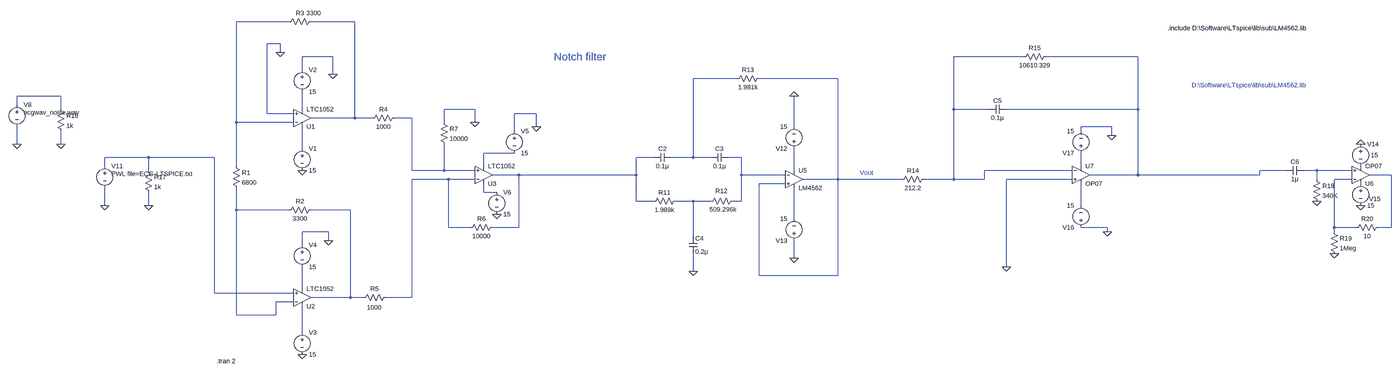
[diagram p0: schematic full_heart_final_final - Copy.asc, whole sheet]
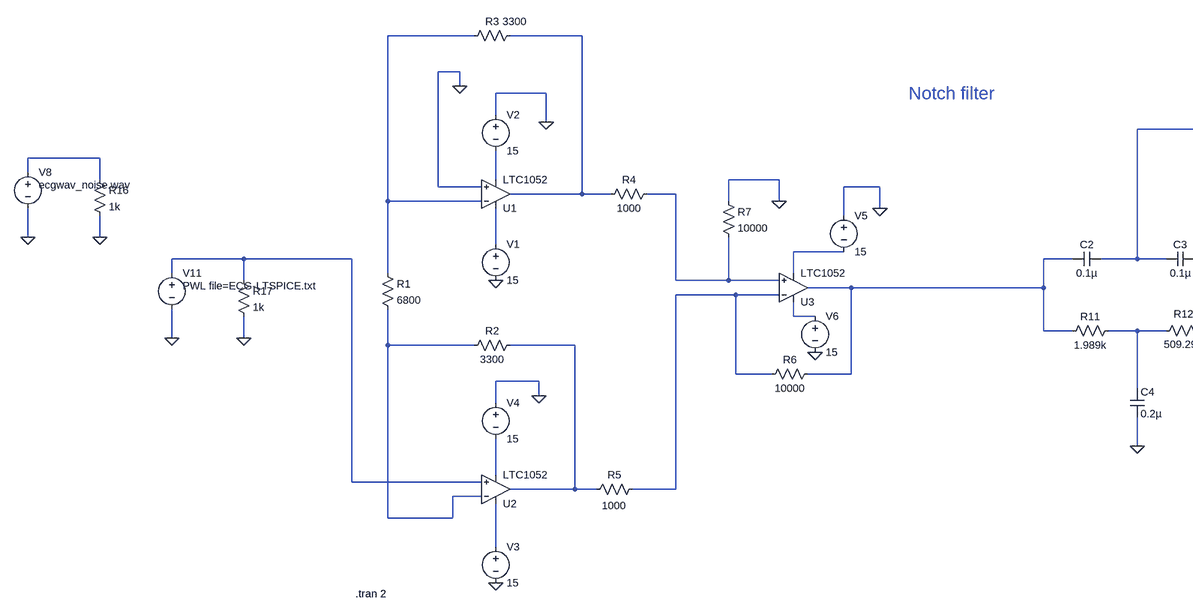
[diagram p1: schematic full_heart_final_final - Copy.asc, part, row 1 of 1, column 1 of 2]
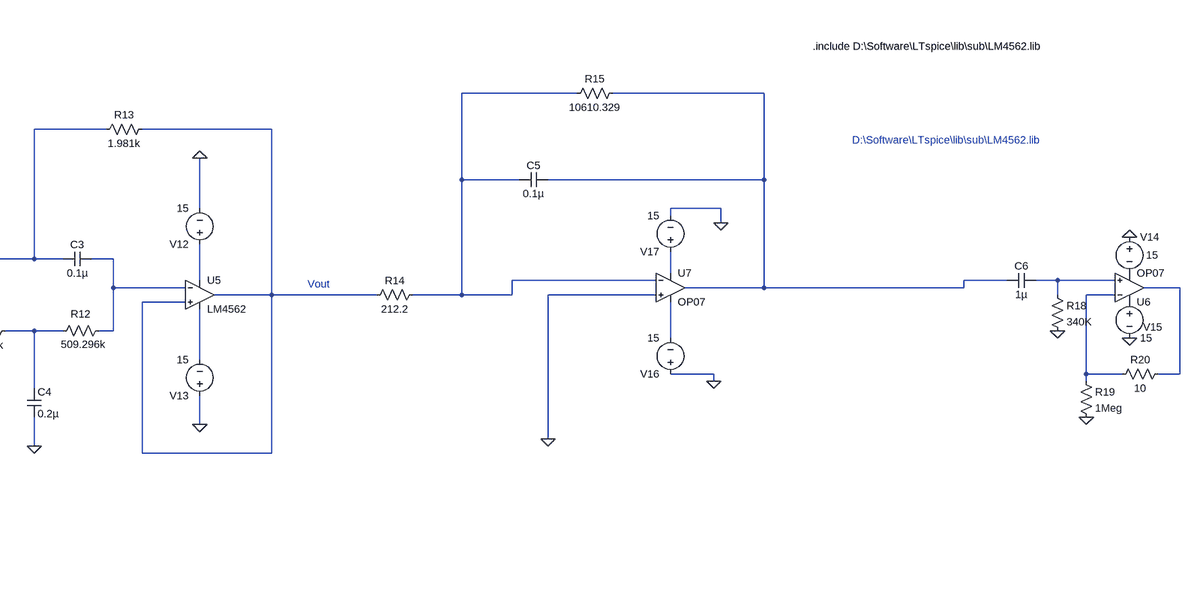
[diagram p2: schematic full_heart_final_final - Copy.asc, part, row 1 of 1, column 2 of 2]
full_heart_final_final - Copy.asc, the LTspice schematic file:
Version 4
SHEET 1 6052 1816
WIRE -992 -208 -1184 -208
WIRE -752 -208 -912 -208
WIRE -1024 -128 -1072 -128
WIRE -1024 -96 -1024 -128
WIRE -832 -80 -944 -80
WIRE 1856 -80 1600 -80
WIRE 2272 -80 1936 -80
WIRE -944 -32 -944 -80
WIRE -832 -16 -832 -80
WIRE 800 0 640 0
WIRE 1168 0 880 0
WIRE -1824 64 -1984 64
WIRE -1984 96 -1984 64
WIRE -1824 112 -1824 64
WIRE -944 112 -944 48
WIRE -256 112 -368 112
WIRE 1600 112 1600 -80
WIRE 1728 112 1600 112
WIRE 2272 112 2272 -80
WIRE 2272 112 1792 112
WIRE -1072 128 -1072 -128
WIRE -976 128 -1072 128
WIRE -32 128 -112 128
WIRE -752 144 -752 -208
WIRE -752 144 -912 144
WIRE -688 144 -752 144
WIRE -544 144 -608 144
WIRE -1184 160 -1184 -208
WIRE -976 160 -1184 160
WIRE -368 160 -368 112
WIRE -256 160 -256 112
WIRE -32 176 -32 128
WIRE 1008 176 1008 64
WIRE 2176 176 2064 176
WIRE -112 192 -112 128
WIRE 2064 192 2064 176
WIRE 2176 208 2176 176
WIRE -1984 240 -1984 176
WIRE -1824 240 -1824 192
WIRE -944 256 -944 176
WIRE -112 272 -224 272
WIRE -1504 288 -1664 288
WIRE -1264 288 -1504 288
WIRE 496 288 432 288
WIRE 640 288 640 0
WIRE 640 288 560 288
WIRE 704 288 640 288
WIRE 816 288 768 288
WIRE -1664 320 -1664 288
WIRE -1184 320 -1184 160
WIRE -224 320 -224 272
WIRE 2064 320 2064 272
WIRE -1504 336 -1504 288
WIRE -544 336 -544 144
WIRE -368 336 -368 240
WIRE -368 336 -544 336
WIRE -256 336 -368 336
WIRE 1008 336 1008 256
WIRE 2032 336 1712 336
WIRE 2832 336 2736 336
WIRE 2944 336 2896 336
WIRE 3072 336 2944 336
WIRE -96 352 -192 352
WIRE 432 352 432 288
WIRE 432 352 -96 352
WIRE 816 352 816 288
WIRE 976 352 816 352
WIRE 2272 352 2272 112
WIRE 2272 352 2096 352
WIRE 2736 352 2736 336
WIRE 2736 352 2272 352
WIRE 3216 352 3136 352
WIRE -352 368 -544 368
WIRE -256 368 -352 368
WIRE 1168 368 1168 0
WIRE 1168 368 1040 368
WIRE 1408 368 1168 368
WIRE 1600 368 1600 112
WIRE 1600 368 1488 368
WIRE 1712 368 1712 336
WIRE 1712 368 1600 368
WIRE 2032 368 1792 368
WIRE 2944 368 2944 336
WIRE 3072 368 3008 368
WIRE 976 384 880 384
WIRE -224 416 -224 384
WIRE -176 416 -224 416
WIRE 432 448 432 352
WIRE 496 448 432 448
WIRE 640 448 576 448
WIRE 704 448 640 448
WIRE 816 448 816 352
WIRE 816 448 784 448
WIRE -1664 464 -1664 400
WIRE -1504 464 -1504 416
WIRE 2064 464 2064 384
WIRE -1184 480 -1184 400
WIRE -992 480 -1184 480
WIRE -768 480 -912 480
WIRE 1008 512 1008 400
WIRE -352 544 -352 368
WIRE -272 544 -352 544
WIRE -96 544 -96 352
WIRE -96 544 -192 544
WIRE 2160 544 2064 544
WIRE 3008 544 3008 368
WIRE 3088 544 3008 544
WIRE 3216 544 3216 352
WIRE 3216 544 3168 544
WIRE -848 560 -944 560
WIRE 2160 560 2160 544
WIRE 3008 560 3008 544
WIRE 640 576 640 448
WIRE -848 592 -848 560
WIRE -944 608 -944 560
WIRE 1008 656 1008 592
WIRE 1792 688 1792 368
WIRE 640 704 640 640
WIRE 880 720 880 384
WIRE 1168 720 1168 368
WIRE 1168 720 880 720
WIRE -944 768 -944 688
WIRE -1264 784 -1264 288
WIRE -976 784 -1264 784
WIRE -768 800 -768 480
WIRE -768 800 -912 800
WIRE -720 800 -768 800
WIRE -544 800 -544 368
WIRE -544 800 -640 800
WIRE -976 816 -1040 816
WIRE -1184 864 -1184 480
WIRE -1040 864 -1040 816
WIRE -1040 864 -1184 864
WIRE -944 928 -944 832
FLAG -256 160 0
FLAG -944 336 0
FLAG -944 1008 0
FLAG -848 592 0
FLAG -832 -16 0
FLAG -176 496 0
FLAG -32 176 0
FLAG -1024 -96 0
FLAG 1008 64 0
FLAG 1008 656 0
FLAG 640 704 0
FLAG 1792 688 0
FLAG 2176 208 0
FLAG 2160 560 0
FLAG -1984 240 0
FLAG -1824 240 0
FLAG -1664 464 0
FLAG -1504 464 0
FLAG 3008 640 0
FLAG 3104 464 0
FLAG 3104 240 0
FLAG 2944 448 0
SYMBOL OpAmps\\LTC1052 -944 208 M180
SYMATTR InstName U1
SYMBOL OpAmps\\LTC1052 -944 864 M180
SYMATTR InstName U2
SYMBOL res -1200 304 R0
SYMATTR InstName R1
SYMATTR Value 6800
SYMBOL res -896 464 R90
WINDOW 0 0 56 VBottom 2
WINDOW 3 32 56 VTop 2
SYMATTR InstName R2
SYMATTR Value 3300
SYMBOL res -896 -224 R90
WINDOW 0 0 56 VBottom 2
WINDOW 3 -31 6 VTop 2
SYMATTR InstName R3
SYMATTR Value 3300
SYMBOL res -592 128 R90
WINDOW 0 0 56 VBottom 2
WINDOW 3 32 56 VTop 2
SYMATTR InstName R4
SYMATTR Value 1000
SYMBOL res -624 784 R90
WINDOW 0 0 56 VBottom 2
WINDOW 3 37 57 VTop 2
SYMATTR InstName R5
SYMATTR Value 1000
SYMBOL OpAmps\\LTC1052 -224 416 M180
SYMATTR InstName U3
SYMBOL res -176 528 R90
WINDOW 0 0 56 VBottom 2
WINDOW 3 32 56 VTop 2
SYMATTR InstName R6
SYMATTR Value 10000
SYMBOL res -384 144 R0
SYMATTR InstName R7
SYMATTR Value 10000
SYMBOL voltage -944 240 R0
WINDOW 123 0 0 Left 0
WINDOW 39 0 0 Left 0
SYMATTR InstName V1
SYMATTR Value 15
SYMBOL voltage -944 -48 R0
WINDOW 123 0 0 Left 0
WINDOW 39 0 0 Left 0
SYMATTR InstName V2
SYMATTR Value 15
SYMBOL voltage -944 912 R0
WINDOW 123 0 0 Left 0
WINDOW 39 0 0 Left 0
SYMATTR InstName V3
SYMATTR Value 15
SYMBOL voltage -944 592 R0
WINDOW 123 0 0 Left 0
WINDOW 39 0 0 Left 0
SYMATTR InstName V4
SYMATTR Value 15
SYMBOL voltage -112 176 R0
WINDOW 123 0 0 Left 0
WINDOW 39 0 0 Left 0
SYMATTR InstName V5
SYMATTR Value 15
SYMBOL voltage -176 400 R0
WINDOW 123 0 0 Left 0
WINDOW 39 0 0 Left 0
SYMATTR InstName V6
SYMATTR Value 15
SYMBOL voltage 1008 272 R180
WINDOW 123 0 0 Left 0
WINDOW 39 0 0 Left 0
SYMATTR InstName V12
SYMATTR Value 15
SYMBOL res 592 432 R90
WINDOW 0 0 56 VBottom 2
WINDOW 3 32 56 VTop 2
SYMATTR InstName R11
SYMATTR Value 1.989k
SYMBOL res 800 432 R90
WINDOW 0 -6 57 VBottom 2
WINDOW 3 31 51 VTop 2
SYMATTR InstName R12
SYMATTR Value 509.296k
SYMBOL cap 560 272 R90
WINDOW 0 0 32 VBottom 2
WINDOW 3 32 32 VTop 2
SYMATTR InstName C2
SYMATTR Value 0.1µ
SYMBOL cap 768 272 R90
WINDOW 0 0 32 VBottom 2
WINDOW 3 32 32 VTop 2
SYMATTR InstName C3
SYMATTR Value 0.1µ
SYMBOL cap 624 576 R0
SYMATTR InstName C4
SYMATTR Value 0.2µ
SYMBOL voltage 1008 608 R180
WINDOW 123 0 0 Left 0
WINDOW 39 0 0 Left 0
SYMATTR InstName V13
SYMATTR Value 15
SYMBOL res 896 -16 R90
WINDOW 0 0 56 VBottom 2
WINDOW 3 32 56 VTop 2
SYMATTR InstName R13
SYMATTR Value 1.981k
SYMBOL OpAmps\\opamp2 1008 304 R0
SYMATTR InstName U5
SYMATTR Value LM4562
SYMBOL res 1504 352 R90
WINDOW 0 0 56 VBottom 2
WINDOW 3 32 56 VTop 2
SYMATTR InstName R14
SYMATTR Value 212.2
SYMBOL cap 1792 96 R90
WINDOW 0 0 32 VBottom 2
WINDOW 3 32 32 VTop 2
SYMATTR InstName C5
SYMATTR Value 0.1µ
SYMBOL voltage 2064 560 R180
WINDOW 123 0 0 Left 0
WINDOW 39 0 0 Left 0
SYMATTR InstName V16
SYMATTR Value 15
SYMBOL voltage 2064 288 R180
WINDOW 123 0 0 Left 0
WINDOW 39 0 0 Left 0
SYMATTR InstName V17
SYMATTR Value 15
SYMBOL res 1952 -96 R90
WINDOW 0 0 56 VBottom 2
WINDOW 3 32 56 VTop 2
SYMATTR InstName R15
SYMATTR Value 10610.329
SYMBOL OpAmps\\OP07 2064 288 R0
SYMATTR InstName U7
SYMBOL voltage -1984 80 R0
WINDOW 3 24 44 Left 2
SYMATTR InstName V8
SYMATTR Value ecgwav_noise.wav
SYMBOL res -1840 96 R0
SYMATTR InstName R16
SYMATTR Value 1k
SYMBOL voltage -1664 304 R0
WINDOW 3 24 44 Left 2
WINDOW 123 0 0 Left 0
WINDOW 39 0 0 Left 0
SYMATTR InstName V11
SYMATTR Value PWL file=ECG-LTSPICE.txt
SYMBOL res -1520 320 R0
SYMATTR InstName R17
SYMATTR Value 1k
SYMBOL voltage 3104 224 R0
WINDOW 3 37 56 Left 2
WINDOW 123 0 0 Left 0
WINDOW 39 0 0 Left 0
SYMATTR Value 15
SYMATTR InstName V14
SYMBOL voltage 3104 368 R0
WINDOW 0 30 72 Left 2
WINDOW 123 0 0 Left 0
WINDOW 39 0 0 Left 0
SYMATTR InstName V15
SYMATTR Value 15
SYMBOL cap 2896 320 R90
WINDOW 0 0 32 VBottom 2
WINDOW 3 32 32 VTop 2
SYMATTR InstName C6
SYMATTR Value 1µ
SYMBOL res 2928 352 R0
SYMATTR InstName R18
SYMATTR Value 340K
SYMATTR SpiceLine tol=1 pwr=0.1
SYMBOL OpAmps\\OP07 3104 416 M180
SYMATTR InstName U6
SYMBOL res 2992 544 R0
SYMATTR InstName R19
SYMATTR Value 1Meg
SYMBOL res 3184 528 R90
WINDOW 0 0 56 VBottom 2
WINDOW 3 32 56 VTop 2
SYMATTR InstName R20
SYMATTR Value 10
TEXT 1248 344 Left 2 ;Vout
TEXT 32 -80 Left 4 ;Notch filter
TEXT 2488 24 Left 2 ;D:\\Software\\LTspice\\lib\\sub\\LM4562.lib
TEXT 2400 -184 Left 2 !.include D:\\Software\\LTspice\\lib\\sub\\LM4562.lib
TEXT -1256 1032 Left 2 !.tran 2

The netlist it stands for:
* full_heart_final_final - Copy.asc
XU1 0 N001 N010 N008 N002 LTC1052  ; pins In+ In- V+ V- OUT
XU2 N012 N024 N028 N027 N025 LTC1052  ; pins In+ In- V+ V- OUT
R1 N001 N024 6800
R2 N025 N024 3300
R3 N002 N001 3300
R4 N009 N002 1000
R5 N019 N025 1000
XU3 N009 N019 N021 N011 N013 LTC1052  ; pins In+ In- V+ V- OUT
R6 N013 N019 10000
R7 0 N009 10000
V1 N010 0 15
V2 0 N008 15
V3 N028 0 15
V4 0 N027 15
V5 0 N011 15
V6 N021 0 15
V12 N016 0 15
R11 N022 N013 1.989k
R12 N014 N022 509.296k
C2 N005 N013 0.1µ
C3 N014 N005 0.1µ
C4 N022 0 0.2µ
V13 0 N026 15
R13 N006 N005 1.981k
XU5 N006 N014 N016 N026 N006 LM4562  ; pins In+ In- V+ V- OUT
R14 N003 N006 212.2
C5 N004 N003 0.1µ
V16 0 N023 15
V17 N015 0 15
R15 N004 N003 10610.329
XU7 0 N003 N015 N023 N004 LT1001  ; OP07, pins In+ In- V+ V- OUT
V8 N007 0 ecgwav_noise.wav
R16 N007 0 1k
V11 N012 0 PWL file=ECG-LTSPICE.txt
R17 N012 0 1k
V14 0 P001 15
V15 P002 0 15
C6 N017 N004 1µ
R18 N017 0 340K tol=1 pwr=0.1
XU6 N017 N020 P002 P001 N018 LT1001  ; OP07, pins In+ In- V+ V- OUT
R19 N020 0 1Meg
R20 N018 N020 10
* Vout
* Notch filter
* D:\Software\LTspice\lib\sub\LM4562.lib
.include D:\Software\LTspice\lib\sub\LM4562.lib
.tran 2
.lib LTC.lib
.backanno
.end